# Altium schematic sheet Sch_mcu_brd_pwr.SchDoc
size A
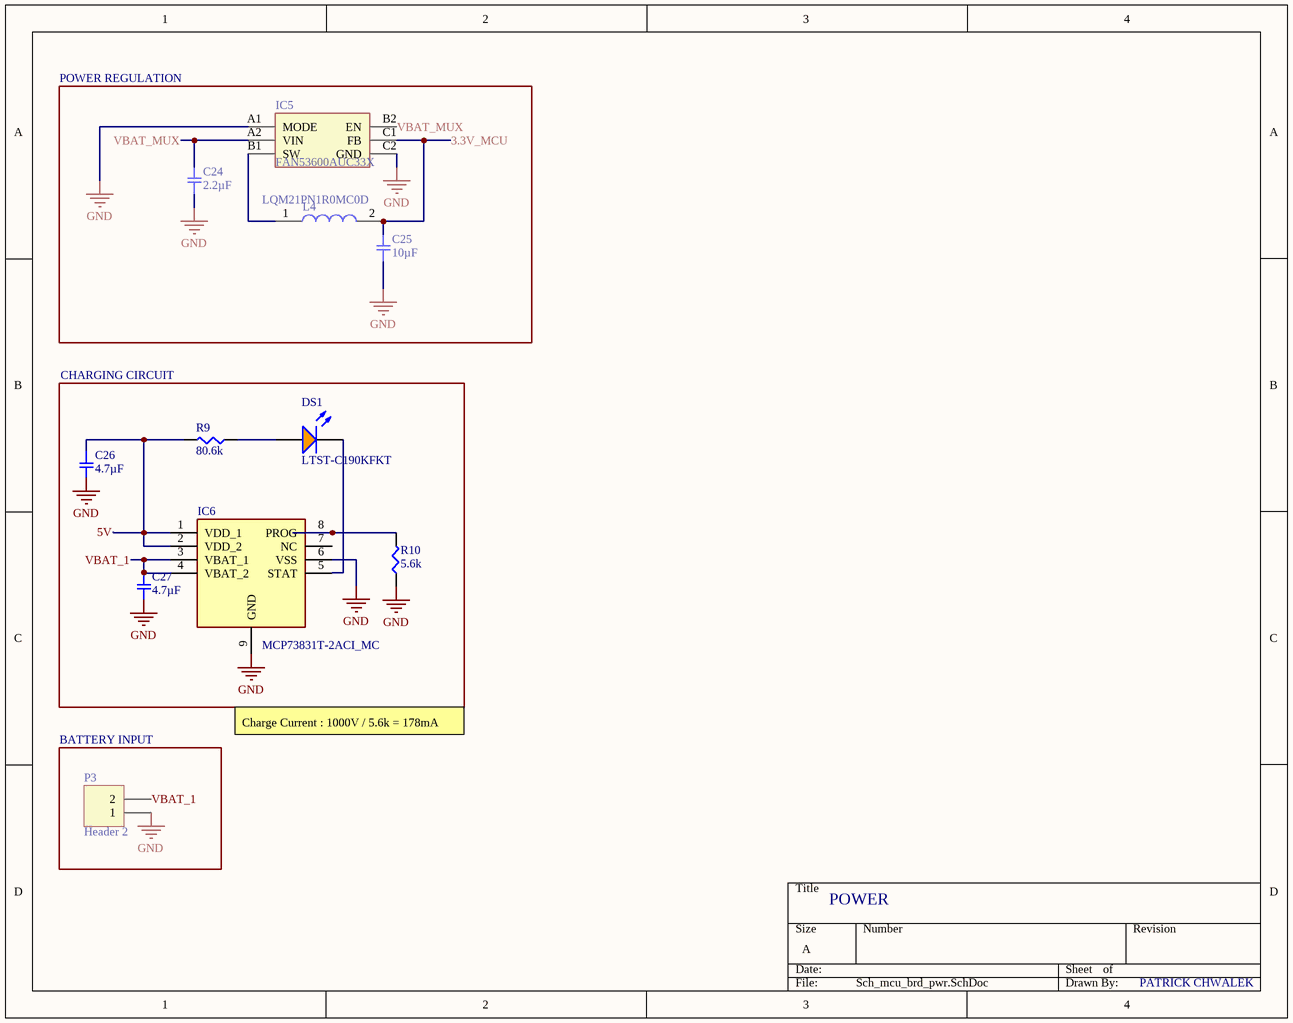
[diagram p0: Sch_mcu_brd_pwr.SchDoc]

## Parts
C24  2.2µF  [SMD-0402C]
C25  10µF  [SMD-0603C]
C26  4.7µF  [SMD-0402C]
C27  4.7µF  [SMD-0402C]
DS1  LTST-C190KFKT  [LTST-C190KFKT_V]
IC5  FAN53600AUC33X  [BGA6C40P2X3_86X116X62]
IC6  MCP73831T-2ACI_MC  [SON50P300X200X100-9N-D]
L4  LQM21PN1R0MC0D  [INDC2012X55N]
P3  Header 2  [HDR1X2]
R9  80.6k  [SMD-0402-RES]
R10  5.6k  [SMD-0402-RES]

## Blocks framed on the sheet
POWER REGULATION: C24 C25 IC5 L4
CHARGING CIRCUIT: C26 C27 DS1 IC6 R9 R10
BATTERY INPUT: P3

## Nets
GND: C24.1 C25.1 C26.2 C27.2 IC5.A1(MODE) IC5.C2(GND) IC6.6(VSS) IC6.9(GND) P3.1 R10.1
3.3V_MCU: C25.2 IC5.C1(FB) L4.2
5V: C26.1 IC6.1(VDD_1) IC6.2(VDD_2) R9.2
VBAT_1: C27.1 IC6.3(VBAT_1) IC6.4(VBAT_2) P3.2
VBAT_MUX: C24.2 IC5.A2(VIN) IC5.B2(EN)
NetDS1_1: DS1.1(A) R9.1
NetDS1_2: DS1.2(K) IC6.5(STAT)
NetIC5_B1: IC5.B1(SW) L4.1
NetIC6_8: IC6.8(PROG) R10.2

Not connected (* = marked no-connect by the designer): IC6 7(NC)

## Notes on the sheet
- Charge Current : 1000V / 5.6k = 178mA
- POWER
- PATRICK CHWALEK

## Library data of the parts
C24 = GRM155R60J225ME15D: CAP CER 2.2UF 6.3V X5R 0402; Manufacturer: Murata Electronics North America; Factory Stock: 0; Unit Price (USD): 0.15; Minimum Quantity: 1; Tolerance: ±20%; Datasheets: http://www.murata.com/~/media/webrenewal/support/library/catalog/products/capacitor/mlcc/c02e.pdf; Image: //media.digikey.com/Renders/Murata%20Renders/ZRB-SERIES-0402.jpg; Digi-Key Part Number: 490-4519-1-ND; Part Number: GRM155R60J225ME15D; Quantity Available: 911621; @ qty: 0; Packaging: Cut Tape (CT); Series: GRM; Part Status: Active; Value: 2.2µF; Voltage: 6.3V; Temperature Coefficient: X5R; Operating Temperature: -55°C ~ 85°C; Features: Derating Recommended; Ratings: -; Applications: General Purpose; Mounting Type: Surface Mount, MLCC; Package / Case: 0402 (1005 Metric); Size / Dimension: 0.039" L x 0.020" W (1.00mm x 0.50mm); Height - Seated (Max): -; Thickness (Max): 0.022" (0.55mm); Lead Spacing: -; Lead Style: -
C25 = GRM188R60J106ME47D: CAP CER 10UF 6.3V X5R 0603; Manufacturer: Murata Electronics North America; Factory Stock: 0; Unit Price (USD): 0.15; Minimum Quantity: 1; Tolerance: ±20%; Datasheets: http://www.murata.com/~/media/webrenewal/support/library/catalog/products/capacitor/mlcc/c02e.pdf; Image: //media.digikey.com/Renders/Murata%20Renders/ZRB-SERIES-0402.jpg; Digi-Key Part Number: 490-3896-1-ND; Part Number: GRM188R60J106ME47D; Quantity Available: 1578882; @ qty: 0; Packaging: Cut Tape (CT); Series: GRM; Part Status: Active; Value: 10µF; Voltage: 6.3V; Temperature Coefficient: X5R; Operating Temperature: -55°C ~ 85°C; Features: -; Ratings: -; Applications: General Purpose; Mounting Type: Surface Mount, MLCC; Package / Case: 0603 (1608 Metric); Size / Dimension: 0.063" L x 0.031" W (1.60mm x 0.80mm); Height - Seated (Max): -; Thickness (Max): 0.035" (0.90mm); Lead Spacing: -; Lead Style: -
C26 C27 = GRM153R60G475ME15D: CAP CER 4.7UF 4V X5R 0402; Manufacturer: Murata Electronics North America; Factory Stock: 0; Unit Price (USD): 0.27; Minimum Quantity: 1; Tolerance: ±20%; Datasheets: http://psearch.en.murata.com/capacitor/product/GRM153R60G475ME15%23.pdf; Image: //media.digikey.com/Renders/Murata%20Renders/ZRB-SERIES-0402.jpg; Digi-Key Part Number: 490-13231-1-ND; Part Number: GRM153R60G475ME15D; Quantity Available: 9100; @ qty: 0; Packaging: Cut Tape (CT); Series: GRM; Part Status: Active; Value: 4.7µF; Voltage: 4V; Temperature Coefficient: X5R; Operating Temperature: -55°C ~ 85°C; Features: -; Ratings: -; Applications: General Purpose; Mounting Type: Surface Mount, MLCC; Package / Case: 0402 (1005 Metric); Size / Dimension: 0.039" L x 0.020" W (1.00mm x 0.50mm); Height - Seated (Max): -; Thickness (Max): 0.013" (0.33mm); Lead Spacing: -; Lead Style: -
DS1 = CMP-1674-00008-1: LED Uni-Color Orange, 75 mW, 30 mA, -35 to 85 degC, 2-Pin SMD, RoHS, Tape and Reel; Resistance: 47 kohm; Power Rating: 100 mW; Case\Package: 0603; Tolerance: 1%; Voltage Rating (DC): 50 V; ComponentLink2URL: http://optoelectronics.liteon.com/upload/download/DS-22-99-0186/S_110_LTST-C190KFKT.pdf; Mount: Surface Mount; Pins: 2; Package Quantity: 5000; Max Operating Temperature: 155 degC; RoHSCompliant: true; PackageDescription: 2-Pin Surface Mount Device, Body 1.6 x 0.8 mm; Case Code (Metric): 1608; PackageReference: C190KFKT; Height: 0.45 mm; ComponentLink2Description: Datasheet; Min Operating Temperature: -55 degC; DatasheetVersion: Rev. I, 09/2011; Packaging: Tape and Reel; ComponentLink1Description: Manufacturer URL; ComponentLink1URL: http://www.us.liteon.com/; Voltage Rating: 50 V; Case Code (Imperial): 0603; Length: 1.6 mm; Width: 0.8 mm; REACH SVHC: No SVHC
IC5 = FAN53600AUC33X: Integrated Circuit; Manufacturer_Name: Fairchild Semiconductor; Datasheet Link: https://www.onsemi.com/pub/Collateral/FAN53610-D.pdf; Height: 0.625mm; Manufacturer_Part_Number: FAN53600AUC33X; Mouser Part Number: 512-FAN53600AUC33X; Mouser Price/Stock: https://www.mouser.com/Search/Refine.aspx?Keyword=512-FAN53600AUC33X
IC6 = MCP73831T-2ACI_MC: Integrated Circuit; Manufacturer_Name: Microchip; Manufacturer_Part_Number: MCP73831T-2ACI/MC; Allied_Number: 70452042; Datasheet Link: http://ww1.microchip.com/downloads/en/DeviceDoc/20001984g.pdf; Height: 1mm; Mouser Part Number: 579-MCP73831T-2ACIMC; Mouser Price/Stock: https://www.mouser.com/Search/Refine.aspx?Keyword=579-MCP73831T-2ACIMC; Allied Price/Stock: https://www.alliedelec.com/microchiptechnologyinc-mcp73831t-2aci-mc/70452042/
L4 = LQM21PN1R0MC0D: Inductor; Manufacturer_Name: Murata Electronics; Datasheet Link: https://componentsearchengine.com/Datasheets/2/LQM21PN1R0MC0D.pdf; Height: 0.55mm; Manufacturer_Part_Number: LQM21PN1R0MC0D; Mouser Part Number: 81-LQM21PN1R0MC0D; Mouser Price/Stock: https://www.mouser.com/Search/Refine.aspx?Keyword=81-LQM21PN1R0MC0D; RS Part Number: 7926388; RS Price/Stock: https://uk.rs-online.com/web/p/products/7926388
P3 = Header 2: Header, 2-Pin; LatestRevisionDate: 17-Jul-2002; LatestRevisionNote: Re-released for DXP Platform.; Publisher: Altium Limited
R9 = ERJ-2RKF8062X: RES SMD 80.6K OHM 1% 1/10W 0402; Manufacturer: Panasonic Electronic Components; Factory Stock: 0; Unit Price (USD): 0.00496; @ qty: 1500; Minimum Quantity: 1; Power (Watts): 0.1W, 1/10W; Temperature Coefficient: ±100ppm/°C; Part Number: ERJ-2RKF8062X; Datasheets: http://industrial.panasonic.com/www-cgi/jvcr13pz.cgi?E+PZ+3+AOA0002+ERJ2RKF8062X+7+WW; Image: //media.digikey.com/Photos/Panasonic%20Photos/ERJ-PA2-Series.jpg; Digi-Key Part Number: P80.6KLCT-ND; Quantity Available: 91747; Packaging: Cut Tape (CT); Series: ERJ; Part Status: Active; Value: 80.6k; Tolerance: ±1%; Composition: Thick Film; Features: Automotive AEC-Q200; Operating Temperature: -55°C ~ 155°C; Package / Case: 0402 (1005 Metric); Supplier Device Package: 0402; Size / Dimension: 0.039" L x 0.020" W (1.00mm x 0.50mm); Height - Seated (Max): 0.016" (0.40mm); Number of Terminations: 2; Failure Rate: -
R10 = ERJ-2GEJ562X: RES SMD 5.6K OHM 5% 1/10W 0402; Manufacturer: Panasonic Electronic Components; Factory Stock: 0; Unit Price (USD): 0.00350; @ qty: 1500; Minimum Quantity: 1; Power (Watts): 0.1W, 1/10W; Temperature Coefficient: ±200ppm/°C; Part Number: ERJ-2GEJ562X; Datasheets: http://industrial.panasonic.com/www-cgi/jvcr13pz.cgi?E+PZ+3+AOA0001+ERJ2GEJ562X+7+WW; Image: //media.digikey.com/Photos/Panasonic%20Photos/ERJ-PA2-Series.jpg; Digi-Key Part Number: P5.6KJCT-ND; Quantity Available: 212112; Packaging: Cut Tape (CT); Series: ERJ; Part Status: Active; Value: 5.6k; Tolerance: ±5%; Composition: Thick Film; Features: Automotive AEC-Q200; Operating Temperature: -55°C ~ 155°C; Package / Case: 0402 (1005 Metric); Supplier Device Package: 0402; Size / Dimension: 0.039" L x 0.020" W (1.00mm x 0.50mm); Height - Seated (Max): 0.016" (0.40mm); Number of Terminations: 2; Failure Rate: -